# Altium schematic sheet Mini_USB_Socket.SchDoc: Mini-USB Socket
size A4; DocumentNumber: 8; SheetNumber: 8; SheetTotal: 12
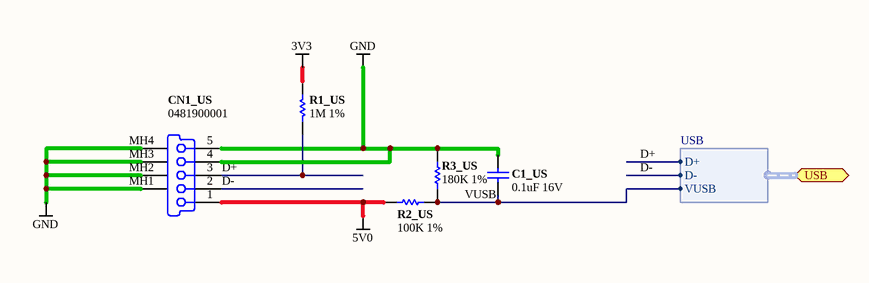
[diagram p0: Mini_USB_Socket.SchDoc]

## Parts
C1_US  0.1uF 16V  [CAPC1005-STAR]
CN1_US  0481900001  [481900001]
R1_US  1M 1%  [RESC1005-STAR]
R2_US  100K 1%  [RESC1005-STAR]
R3_US  180K 1%  [RESC1005-STAR]

## Ports
USB (harness USB)

## Harnesses
USB: VUSB, D-, D+

## Nets
3V3: R1_US.2
5V0: CN1_US.1 R2_US.2
GND: C1_US.1 CN1_US.4 CN1_US.5 CN1_US.MH1 CN1_US.MH2 CN1_US.MH3 CN1_US.MH4 R3_US.2
D+: CN1_US.3 R1_US.1 ; port USB.D+
D-: CN1_US.2 ; port USB.D-
VUSB: C1_US.2 R2_US.1 R3_US.1 ; port USB.VUSB

## Notes on the sheet
- Sheet Title
- Project Title
- Size:
- Date:
- A4
- Assy:
- Time:
- Revision:
- Sheet
- of
- File:

## Library data of the parts
C1_US = D-101-0080: Capacitor, Ceramic, 0.1uF 10% 16V 0402 (1005) X7R; Polarity: Non-Polarized; Category: Capacitor; Capacitance: 0.1 uF; Dielectric: X7R; Mounting Technology: Surface Mount; Rated Voltage: 16 V; Status: Production; Technology: Ceramic; Tolerance: 10 %
CN1_US = D-300-0034: USB On-The-Go (OTG) Mini-B Receptacle, Right Angle, SMT, 0.80mm (.031") Pitch, Solder Tabs with Back Cover, Recessed Type; Max Current: mA; Connector type: Right Angle; Mounting Technology: Surface Mount; Status: Unreleased; Category: Connector
R1_US = D-100-0075: Resistor, 1M 1% 0402; Power Rating: mW; Resistance: mR; Tolerance: %; Category: Resistor; Mounting Technology: Surface Mount; Status: Unreleased
R2_US = D-100-0132: Resistor, 100K 1% 0402 (1005); Power Rating: 63 mW; Category: Resistor; Mounting Technology: Surface Mount; Resistance: 100 K; Status: Production; Tolerance: 1 %
R3_US = D-100-0006: Resistor, 180K 1% 0402 (1005); Power Rating: 63 mW; Tolerance: %; Category: Resistor; Mounting Technology: Surface Mount; Resistance: 180 K; Status: Unreleased